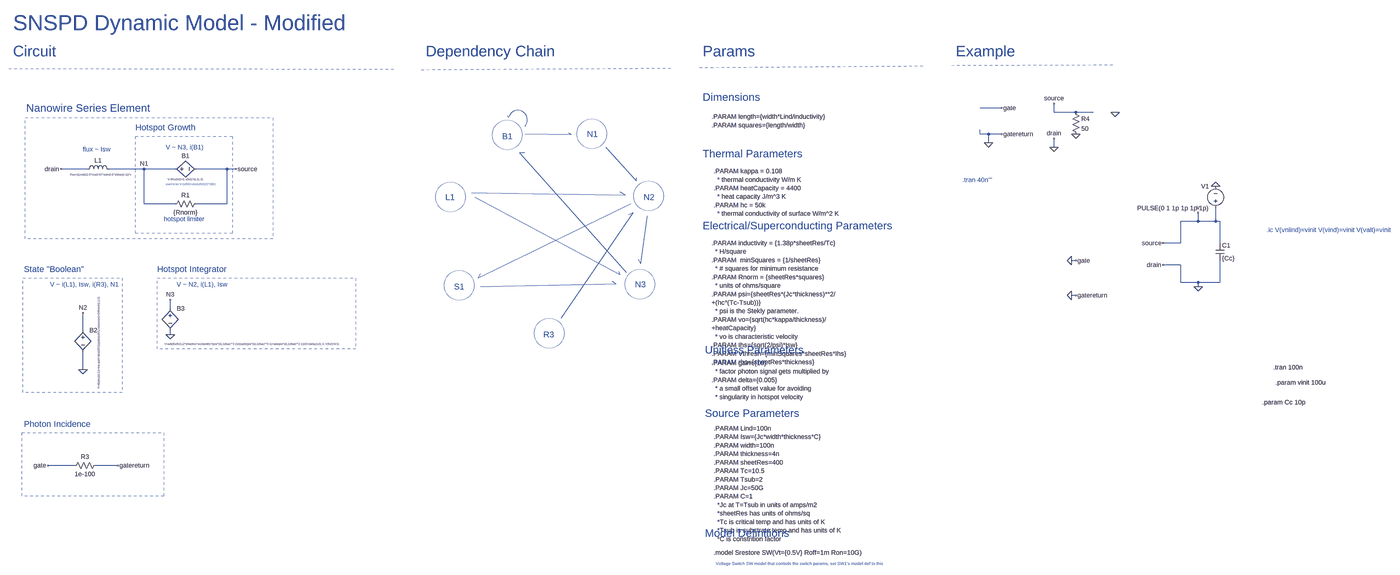
[diagram p0: schematic snspd_model_deconstructed.asc, whole sheet]
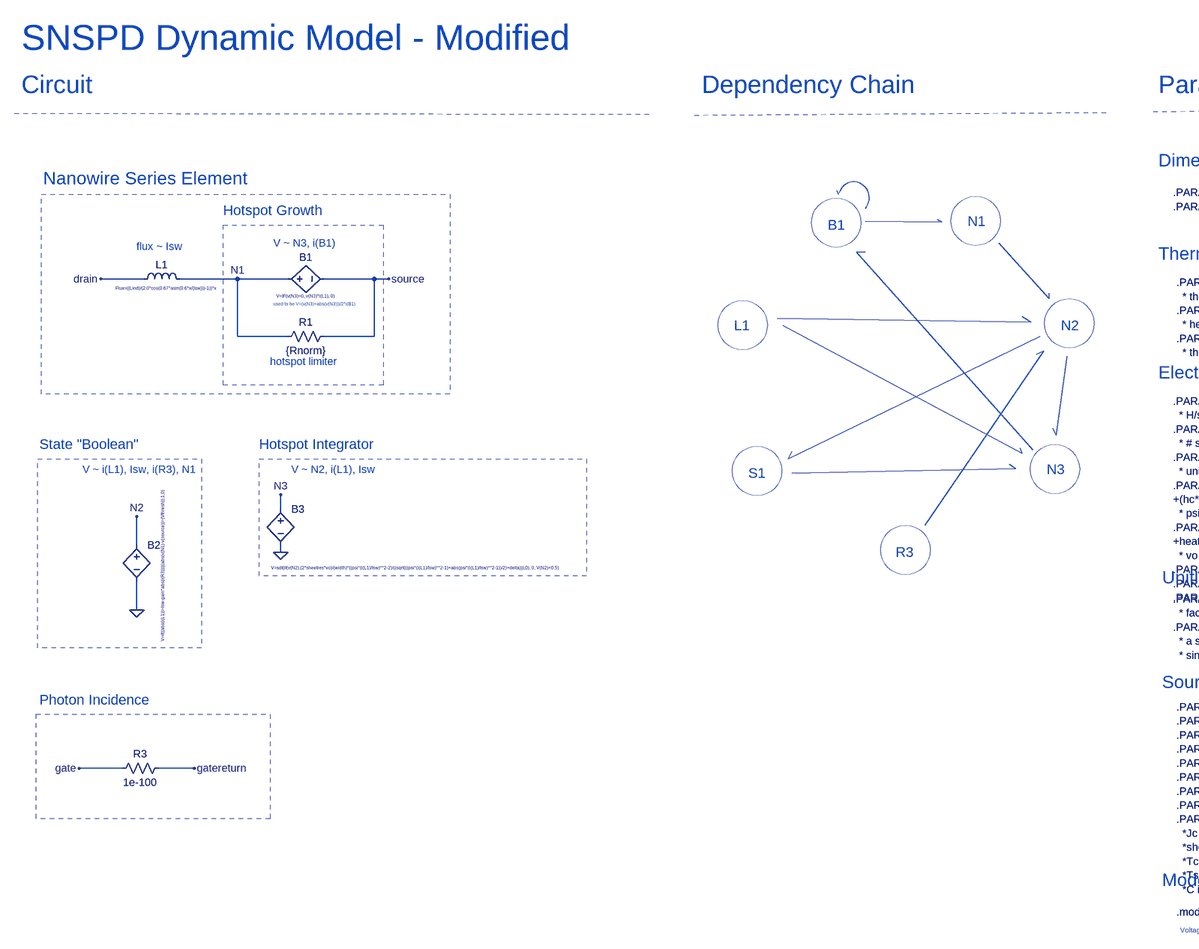
[diagram p1: schematic snspd_model_deconstructed.asc, part, row 1 of 1, column 1 of 2]
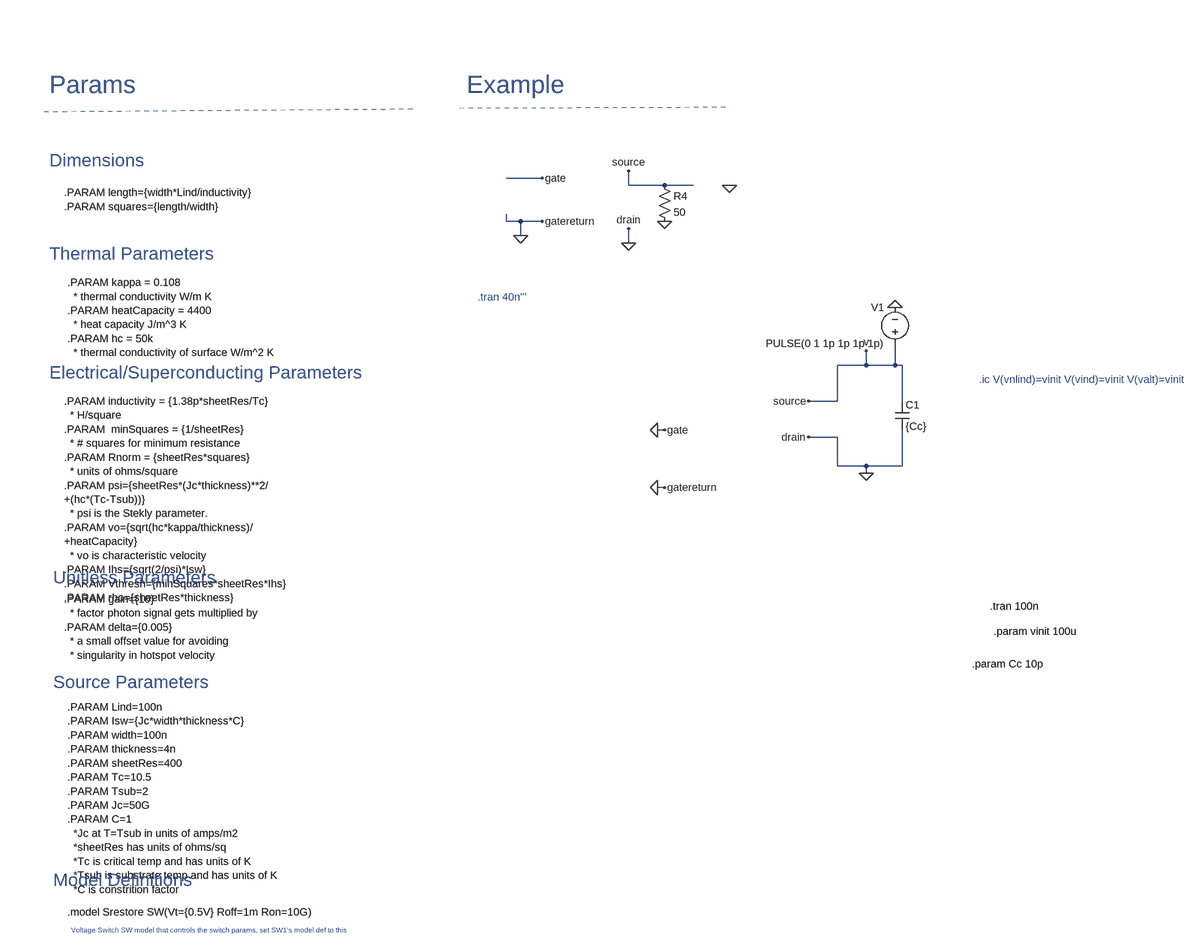
[diagram p2: schematic snspd_model_deconstructed.asc, part, row 1 of 1, column 2 of 2]
snspd_model_deconstructed.asc, the LTspice schematic file:
Version 4
SHEET 1 5832 2076
WIRE 3840 144 3760 144
WIRE 4032 160 4032 128
WIRE 4112 160 4032 160
WIRE 4176 160 4112 160
WIRE 3760 240 3760 224
WIRE 3792 240 3760 240
WIRE 3840 240 3792 240
WIRE 3792 272 3792 240
WIRE 4032 288 4032 256
WIRE 304 368 208 368
WIRE 512 368 384 368
WIRE 624 368 512 368
WIRE 816 368 704 368
WIRE 848 368 816 368
WIRE 512 496 512 368
WIRE 624 496 512 496
WIRE 816 496 816 368
WIRE 816 496 704 496
WIRE 4560 560 4560 528
WIRE 4560 560 4496 560
WIRE 4624 560 4624 512
WIRE 4624 560 4560 560
WIRE 4640 560 4624 560
WIRE 4496 640 4496 560
WIRE 4496 640 4432 640
WIRE 4640 640 4640 560
WIRE 4112 704 4096 704
WIRE 4496 720 4432 720
WIRE 4496 784 4496 720
WIRE 4560 784 4496 784
WIRE 4640 784 4640 704
WIRE 4640 784 4560 784
WIRE 4560 800 4560 784
WIRE 4112 832 4096 832
WIRE 608 880 608 848
WIRE 288 960 288 896
WIRE 608 976 608 960
WIRE 288 1104 288 1040
WIRE 256 1456 160 1456
WIRE 416 1456 336 1456
FLAG 208 368 drain
FLAG 512 368 N1
FLAG 848 368 source
FLAG 288 896 N2
FLAG 288 1104 0
FLAG 608 848 N3
FLAG 608 976 0
FLAG 160 1456 gate
FLAG 416 1456 gatereturn
FLAG 4256 160 0
FLAG 4112 240 0
FLAG 4032 128 source
FLAG 4032 256 drain
FLAG 4032 288 0
FLAG 3792 272 0
FLAG 3840 240 gatereturn
FLAG 3840 144 gate
FLAG 4432 640 source
FLAG 4432 720 drain
FLAG 4112 832 gatereturn
FLAG 4112 704 gate
FLAG 4096 704 0
FLAG 4096 832 0
FLAG 4560 800 0
FLAG 4560 528 v
FLAG 4624 432 0
SYMBOL ind 288 384 R270
WINDOW 0 32 56 VTop 2
WINDOW 3 -5 175 VLeft 0
SYMATTR InstName L1
SYMATTR Value Flux=({Lind}/(2.0*cos(0.67*asin(0.6*x/{Isw}))-1))*x
SYMATTR SpiceLine Rser=1e-100
SYMBOL bv 608 368 R270
WINDOW 0 32 56 VTop 2
WINDOW 3 -32 56 VBottom 0
SYMATTR InstName B1
SYMATTR Value V=IF(v(N3)>0, v(N3)*i(L1), 0)
SYMBOL Res 720 480 R90
WINDOW 0 0 56 VBottom 2
WINDOW 3 32 56 VTop 2
SYMATTR InstName R1
SYMATTR Value {Rnorm}
SYMBOL bv 288 944 R0
WINDOW 3 59 231 VLeft 0
SYMATTR Value V=if((abs(i(L1))>Isw-gain*abs(i(R3)))|(abs(v(N1)-v(source))>{Vthresh}),1,0)
SYMATTR InstName B2
SYMBOL Res 352 1440 R90
WINDOW 0 0 56 VBottom 2
WINDOW 3 32 56 VTop 2
SYMATTR InstName R3
SYMATTR Value 1e-100
SYMBOL Res 4096 144 R0
SYMATTR InstName R4
SYMATTR Value 50
SYMBOL bv 608 864 R0
WINDOW 3 -21 147 Left 0
SYMATTR Value V=sdt(if(v(N2),(2*sheetres*vo)/(width)*((psi*(i(L1)/Isw)**2-2)/((sqrt(((psi*(i(L1)/Isw)**2-1)+abs(psi*(i(L1)/Isw)**2-1))/2)+delta))),0), 0, V(N2)<0.5)
SYMATTR InstName B3
SYMBOL Cap 4624 640 R0
SYMATTR InstName C1
SYMATTR Value {Cc}
SYMBOL Voltage 4624 528 R180
WINDOW 0 24 96 Left 2
WINDOW 3 24 16 Left 2
SYMATTR InstName V1
SYMATTR Value PULSE(0 1 1p 1p 1p 1p)
TEXT 288 296 Left 2 ;flux ~ Isw
TEXT 592 288 Left 2 ;V ~ N3, i(B1)
TEXT 584 552 Left 2 ;hotspot limiter
TEXT 168 792 Left 2 ;V ~ i(L1), Isw, i(R3), N1
TEXT 80 144 Left 4 ;Nanowire Series Element
TEXT 32 -168 Left 6 ;SNSPD Dynamic Model - Modified
TEXT 480 216 Left 3 ;Hotspot Growth
TEXT 72 736 Left 3 ;State "Boolean"
TEXT 560 736 Left 3 ;Hotspot Integrator
TEXT 72 1304 Left 3 ;Photon Incidence
TEXT 32 -64 Left 5 ;Circuit
TEXT 1664 -64 Left 5 ;Dependency Chain
TEXT 2728 -64 Left 5 ;Params
TEXT 2728 104 Left 4 ;Dimensions
TEXT 2760 176 Left 2 !.PARAM length={width*Lind/inductivity}\n.PARAM squares={length/width}
TEXT 2728 312 Left 4 ;Thermal Parameters
TEXT 2768 376 Left 2 !.PARAM kappa = 0.108\n  * thermal conductivity W/m K\n.PARAM heatCapacity = 4400\n  * heat capacity J/m^3 K\n.PARAM hc = 50k\n  * thermal conductivity of surface W/m^2 K
TEXT 2728 576 Left 4 ;Electrical/Superconducting Parameters
TEXT 2760 640 Left 2 !.PARAM inductivity = {1.38p*sheetRes/Tc}\n  * H/square\n.PARAM  minSquares = {1/sheetRes}\n  * # squares for minimum resistance\n.PARAM Rnorm = {sheetRes*squares}\n  * units of ohms/square\n.PARAM psi={sheetRes*(Jc*thickness)**2/\n+(hc*(Tc-Tsub))}\n  * psi is the Stekly parameter.\n.PARAM vo={sqrt(hc*kappa/thickness)/\n+heatCapacity}\n  * vo is characteristic velocity\n.PARAM Ihs={sqrt(2/psi)*Isw}\n.PARAM Vthresh={minSquares*sheetRes*Ihs}\n.PARAM rho={sheetRes*thickness}
TEXT 2736 1032 Left 4 ;Unitless Parameters
TEXT 2760 1080 Left 2 !.PARAM gain={10}\n  * factor photon signal gets multiplied by\n.PARAM delta={0.005}\n  * a small offset value for avoiding\n  * singularity in hotspot velocity
TEXT 1944 248 Left 3 ;B1
TEXT 1768 800 Left 3 ;S1
TEXT 1736 472 Left 3 ;L1
TEXT 2296 240 Right 3 ;N1
TEXT 2472 792 Right 3 ;N3
TEXT 2504 472 Right 3 ;N2
TEXT 2136 976 Right 3 ;R3
TEXT 3672 -64 Left 5 ;Example
TEXT 3696 408 Left 2 ;.tran 40n'''
TEXT 2736 1264 Left 4 ;Source Parameters
TEXT 2768 1320 Left 2 !.PARAM Lind=100n \n.PARAM Isw={Jc*width*thickness*C} \n.PARAM width=100n \n.PARAM thickness=4n\n.PARAM sheetRes=400 \n.PARAM Tc=10.5 \n.PARAM Tsub=2\n.PARAM Jc=50G \n.PARAM C=1\n  *Jc at T=Tsub in units of amps/m2\n  *sheetRes has units of ohms/sq\n  *Tc is critical temp and has units of K\n  *Tsub is substrate temp and has units of K\n  *C is constrition factor
TEXT 2736 1704 Left 4 ;Model Definitions
TEXT 2768 1776 Left 2 !.model Srestore SW(Vt={0.5V} Roff=1m Ron=10G)
TEXT 2776 1816 Left 1 ;Voltage Switch SW model that controls the switch params, set SW1's model def to this
TEXT 632 792 Left 2 ;V ~ N2, i(L1), Isw
TEXT 592 424 Left 0 ;used to be V=(v(N3)+abs(v(N3)))/2*i(B1)
TEXT 4952 1096 Left 2 !.tran 100n
TEXT 4960 1152 Left 2 !.param vinit 100u
TEXT 4912 1224 Left 2 !.param Cc 10p
TEXT 4928 592 Left 2 ;.ic V(vnlind)=vinit V(vind)=vinit V(valt)=vinit
LINE Normal 16 0 1437 2 1
LINE Normal 1648 4 2573 -2 1
LINE Normal 2716 -4 3545 -10 1
LINE Normal 1968 180 1964 172
LINE Normal 1964 172 1968 180 4
LINE Normal 2028 240 2198 242
LINE Normal 2198 242 2188 236
LINE Normal 2324 288 2436 412
LINE Normal 2436 412 2436 400
LINE Normal 2416 496 1856 768
LINE Normal 1856 768 1864 752
LINE Normal 2476 540 2452 716
LINE Normal 2452 716 2444 700
LINE Normal 1864 800 2362 790
LINE Normal 2362 790 2348 780
LINE Normal 2400 748 2008 308
LINE Normal 2008 308 2028 308
LINE Normal 1844 472 2376 756
LINE Normal 2376 756 2372 744
LINE Normal 1832 456 2396 464
LINE Normal 2396 464 2376 452
LINE Normal 2160 916 2424 528
LINE Normal 2424 528 2408 536
LINE Normal 3656 -12 4257 -14 1
RECTANGLE Normal 76 180 984 624 1
RECTANGLE Normal 480 248 836 604 1
RECTANGLE Normal 68 768 432 1188 1
RECTANGLE Normal 560 768 1288 1028 1
RECTANGLE Normal 64 1336 584 1568 1
CIRCLE Normal 1908 188 2018 298 1
CIRCLE Normal 1732 740 1842 850 1
CIRCLE Normal 1700 416 1810 526 1
CIRCLE Normal 2328 184 2218 294 1
CIRCLE Normal 2504 736 2394 846 1
CIRCLE Normal 2536 412 2426 522 1
CIRCLE Normal 2172 916 2062 1026 1
ARC Normal 2036 224 1968 152 2032 216 1944 168

The netlist it stands for:
* snspd_model_deconstructed.asc
L1 0 N1 Flux=({Lind}/(2.0*cos(0.67*asin(0.6*x/{Isw}))-1))*x Rser=1e-100
B1 N1 v V=IF(v(N3)>0, v(N3)*i(L1), 0)
R1 v N1 {Rnorm}
B2 N2 0 V=if((abs(i(L1))>Isw-gain*abs(i(R3)))|(abs(v(N1)-v(source))>{Vthresh}),1,0)
R3 0 0 1e-100
R4 v 0 50
B3 N3 0 V=sdt(if(v(N2),(2*sheetres*vo)/(width)*((psi*(i(L1)/Isw)**2-2)/((sqrt(((psi*(i(L1)/Isw)**2-1)+abs(psi*(i(L1)/Isw)**2-1))/2)+delta))),0), 0, V(N2)<0.5)
C1 v 0 {Cc}
V1 v 0 PULSE(0 1 1p 1p 1p 1p)
* flux ~ Isw
* V ~ N3, i(B1)
* hotspot limiter
* V ~ i(L1), Isw, i(R3), N1
* Nanowire Series Element
* SNSPD Dynamic Model - Modified
* Hotspot Growth
* State "Boolean"
* Hotspot Integrator
* Photon Incidence
* Circuit
* Dependency Chain
* Params
* Dimensions
.PARAM length={width*Lind/inductivity}
.PARAM squares={length/width}
* Thermal Parameters
.PARAM kappa = 0.108
  * thermal conductivity W/m K
.PARAM heatCapacity = 4400
  * heat capacity J/m^3 K
.PARAM hc = 50k
  * thermal conductivity of surface W/m^2 K
* Electrical/Superconducting Parameters
.PARAM inductivity = {1.38p*sheetRes/Tc}
  * H/square
.PARAM  minSquares = {1/sheetRes}
  * # squares for minimum resistance
.PARAM Rnorm = {sheetRes*squares}
  * units of ohms/square
.PARAM psi={sheetRes*(Jc*thickness)**2/
+(hc*(Tc-Tsub))}
  * psi is the Stekly parameter.
.PARAM vo={sqrt(hc*kappa/thickness)/
+heatCapacity}
  * vo is characteristic velocity
.PARAM Ihs={sqrt(2/psi)*Isw}
.PARAM Vthresh={minSquares*sheetRes*Ihs}
.PARAM rho={sheetRes*thickness}
* Unitless Parameters
.PARAM gain={10}
  * factor photon signal gets multiplied by
.PARAM delta={0.005}
  * a small offset value for avoiding
  * singularity in hotspot velocity
* B1
* S1
* L1
* N1
* N3
* N2
* R3
* Example
* .tran 40n'''
* Source Parameters
.PARAM Lind=100n
.PARAM Isw={Jc*width*thickness*C}
.PARAM width=100n
.PARAM thickness=4n
.PARAM sheetRes=400
.PARAM Tc=10.5
.PARAM Tsub=2
.PARAM Jc=50G
.PARAM C=1
  *Jc at T=Tsub in units of amps/m2
  *sheetRes has units of ohms/sq
  *Tc is critical temp and has units of K
  *Tsub is substrate temp and has units of K
  *C is constrition factor
* Model Definitions
.model Srestore SW(Vt={0.5V} Roff=1m Ron=10G)
* Voltage Switch SW model that controls the switch params, set SW1's model def to this
* V ~ N2, i(L1), Isw
* used to be V=(v(N3)+abs(v(N3)))/2*i(B1)
.tran 100n
.param vinit 100u
.param Cc 10p
* .ic V(vnlind)=vinit V(vind)=vinit V(valt)=vinit
.backanno
.end